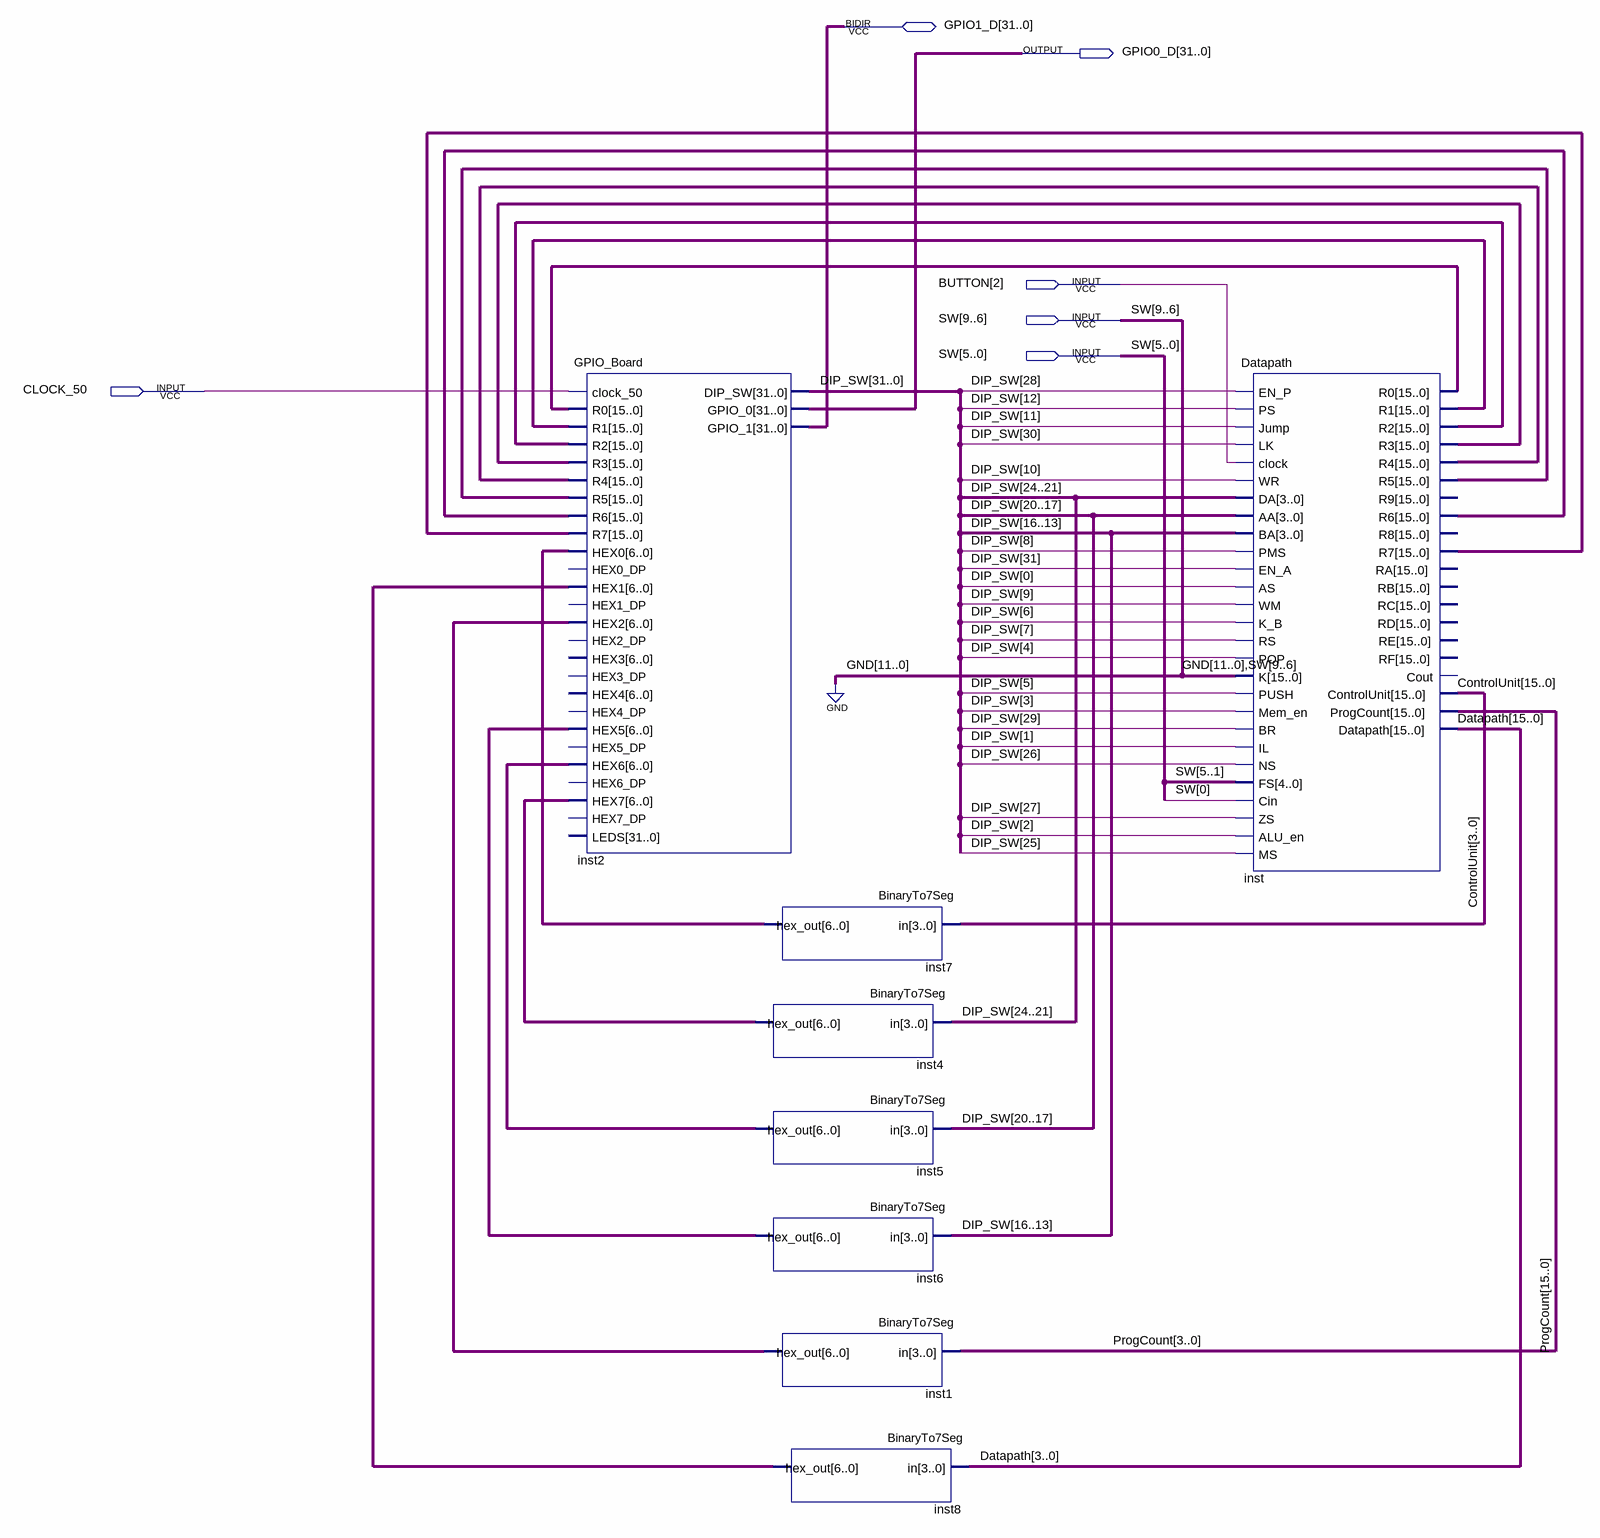
[diagram p0: schematic sheet]
// Quartus schematic GPIO_Datapath.bdf as structural Verilog: 8 symbols, 6 pins
module GPIO_Datapath (
  input  [2:2] BUTTON,
  input  [9:0] SW,
  input  CLOCK_50,
  inout  [31:0] GPIO1_D,
  output [31:0] GPIO0_D
);

  wire [6:0] inst1_hex_out, inst4_hex_out, inst5_hex_out, inst6_hex_out, inst7_hex_out, inst8_hex_out;
  wire [15:0] ControlUnit, Datapath, inst_r0, inst_r1, inst_r2, inst_r3, inst_r4, inst_r5, inst_r6, inst_r7,
       ProgCount;
  wire [31:0] DIP_SW;

  GPIO_Board inst2 (
    .clock_50(CLOCK_50), .R0(inst_r0), .R1(inst_r1), .R2(inst_r2), .R3(inst_r3), .R4(inst_r4), .R5(inst_r5),
    .R6(inst_r6), .R7(inst_r7), .HEX0(inst7_hex_out), .HEX1(inst8_hex_out), .HEX2(inst1_hex_out),
    .HEX5(inst6_hex_out), .HEX6(inst5_hex_out), .HEX7(inst4_hex_out), .DIP_SW(DIP_SW), .GPIO_0(GPIO0_D),
    .GPIO_1(GPIO1_D));  // open: HEX0_DP, HEX1_DP, HEX2_DP, HEX3, HEX3_DP, HEX4, HEX4_DP, HEX5_DP, HEX6_DP, HEX7_DP, LEDS
  BinaryTo7Seg inst7 (.in(ControlUnit[3:0]), .hex_out(inst7_hex_out));
  BinaryTo7Seg inst4 (.in(DIP_SW[24:21]), .hex_out(inst4_hex_out));
  BinaryTo7Seg inst5 (.in(DIP_SW[20:17]), .hex_out(inst5_hex_out));
  BinaryTo7Seg inst6 (.in(DIP_SW[16:13]), .hex_out(inst6_hex_out));
  BinaryTo7Seg inst1 (.in(ProgCount[3:0]), .hex_out(inst1_hex_out));
  BinaryTo7Seg inst8 (.in(Datapath[3:0]), .hex_out(inst8_hex_out));
  Datapath inst (
    .EN_P(DIP_SW[28]), .PS(DIP_SW[12]), .Jump(DIP_SW[11]), .LK(DIP_SW[30]), .clock(BUTTON[2]),
    .WR(DIP_SW[10]), .DA(DIP_SW[24:21]), .AA(DIP_SW[20:17]), .BA(DIP_SW[16:13]), .PMS(DIP_SW[8]),
    .EN_A(DIP_SW[31]), .AS(DIP_SW[0]), .WM(DIP_SW[9]), .K_B(DIP_SW[6]), .RS(DIP_SW[7]), .POP(DIP_SW[4]),
    .K({{12{1'b0}}, SW[9:6]}), .PUSH(DIP_SW[5]), .Mem_en(DIP_SW[3]), .BR(DIP_SW[29]), .IL(DIP_SW[1]),
    .NS(DIP_SW[26]), .FS(SW[5:1]), .Cin(SW[0]), .ZS(DIP_SW[27]), .ALU_en(DIP_SW[2]), .MS(DIP_SW[25]),
    .R0(inst_r0), .R1(inst_r1), .R2(inst_r2), .R3(inst_r3), .R4(inst_r4), .R5(inst_r5), .R6(inst_r6),
    .R7(inst_r7), .ControlUnit(ControlUnit), .ProgCount(ProgCount), .Datapath(Datapath));  // open: R9, R8, RA, RB, RC, RD, RE, RF, Cout
endmodule
